# EAGLE schematic LSN Motherboard 1.2 (EAGLE 6.2)
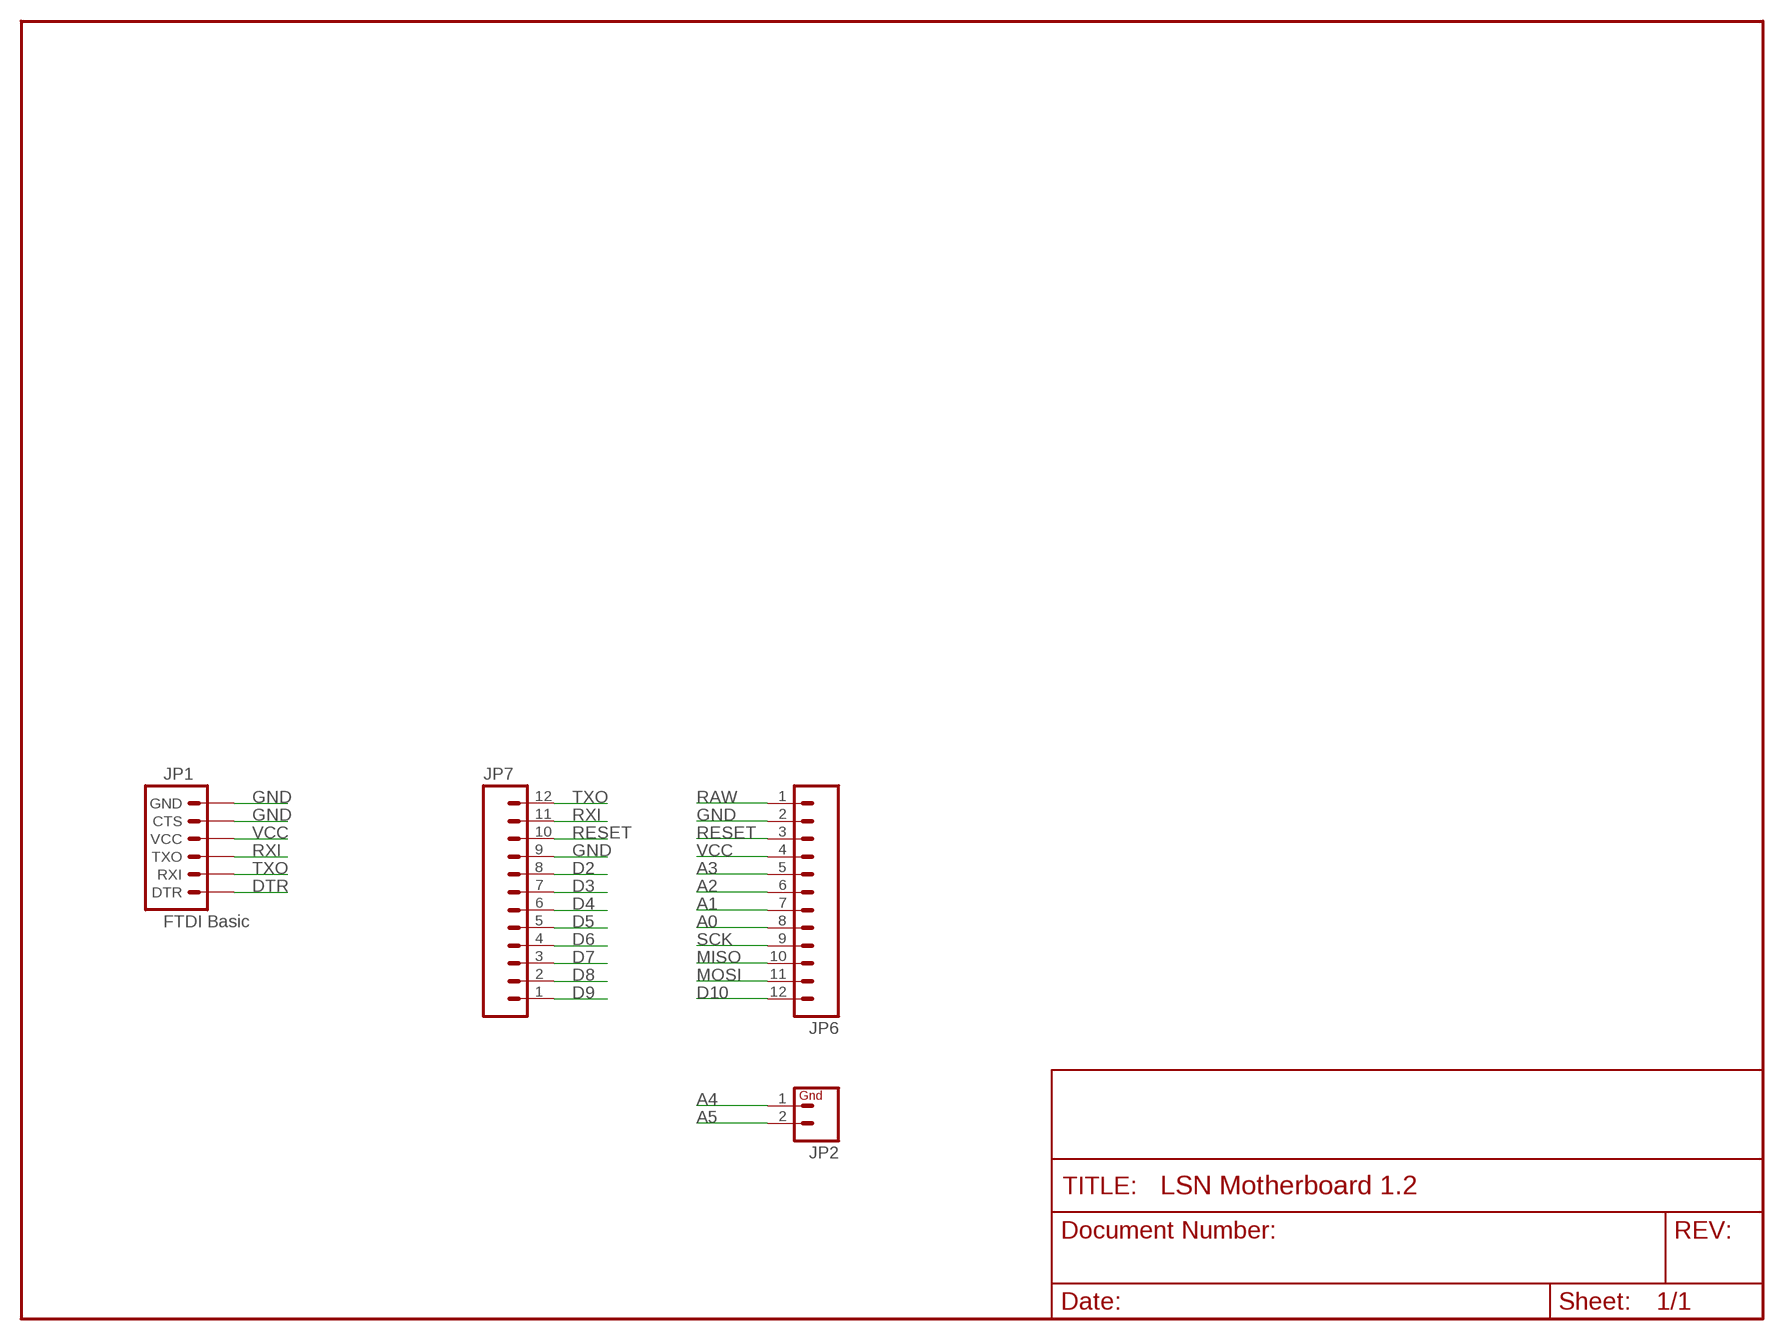
[diagram p0: schematic, sheet 1]

## Parts
JP1  FTDI Basic  ARDUINO_SERIAL_PROGRAMPTH  [1X06]
JP2  M02PTH  [1X02]
JP6  M12PTH  [1X12]
JP7  M12PTH  [1X12]

## Nets
A0: JP6.8
A1: JP6.7
A2: JP6.6
A3: JP6.5
A4: JP2.1
A5: JP2.2
D2: JP7.8
D3: JP7.7
D4: JP7.6
D5: JP7.5
D6: JP7.4
D7: JP7.3
D8: JP7.2
D9: JP7.1
D10: JP6.12
DTR: JP1.1(DTR)
GND [vcc]: JP1.5(CTS) JP1.6(GND) JP6.2 JP7.9
MISO: JP6.10
MOSI: JP6.11
RAW [vcc]: JP6.1
RESET: JP6.3 JP7.10
RXI: JP1.3(TXO) JP7.11
SCK: JP6.9
TXO: JP1.2(RXI) JP7.12
VCC: JP1.4(VCC) JP6.4

## Library data of the parts
JP1 = SparkFun:ARDUINO_SERIAL_PROGRAM
JP2 = SparkFun:M02: Header 2 Standard 2-pin 0.1" header. Use with straight break away headers (SKU : PRT-00116), right angle break away headers (PRT-00553), swiss pins (PRT-00743), machine pins (PRT-00117), and female headers (PRT-00115). Molex polarized connector foot print use with SKU : PRT-08233 with associated crimp pins and housings.
JP6 JP7 = SparkFun:M12: Header 12 Standard 12-pin 0.1" header. Use with straight break away headers (SKU : PRT-00116), right angle break away headers (PRT-00553), swiss pins (PRT-00743), machine pins (PRT-00117), and female headers (PRT-00115).

## Net classes
0 default: width 0.203 mm
1 vcc: width 0.254 mm